# EAGLE design LoRa G-Dual v1.0 (EAGLE 7.5.0)
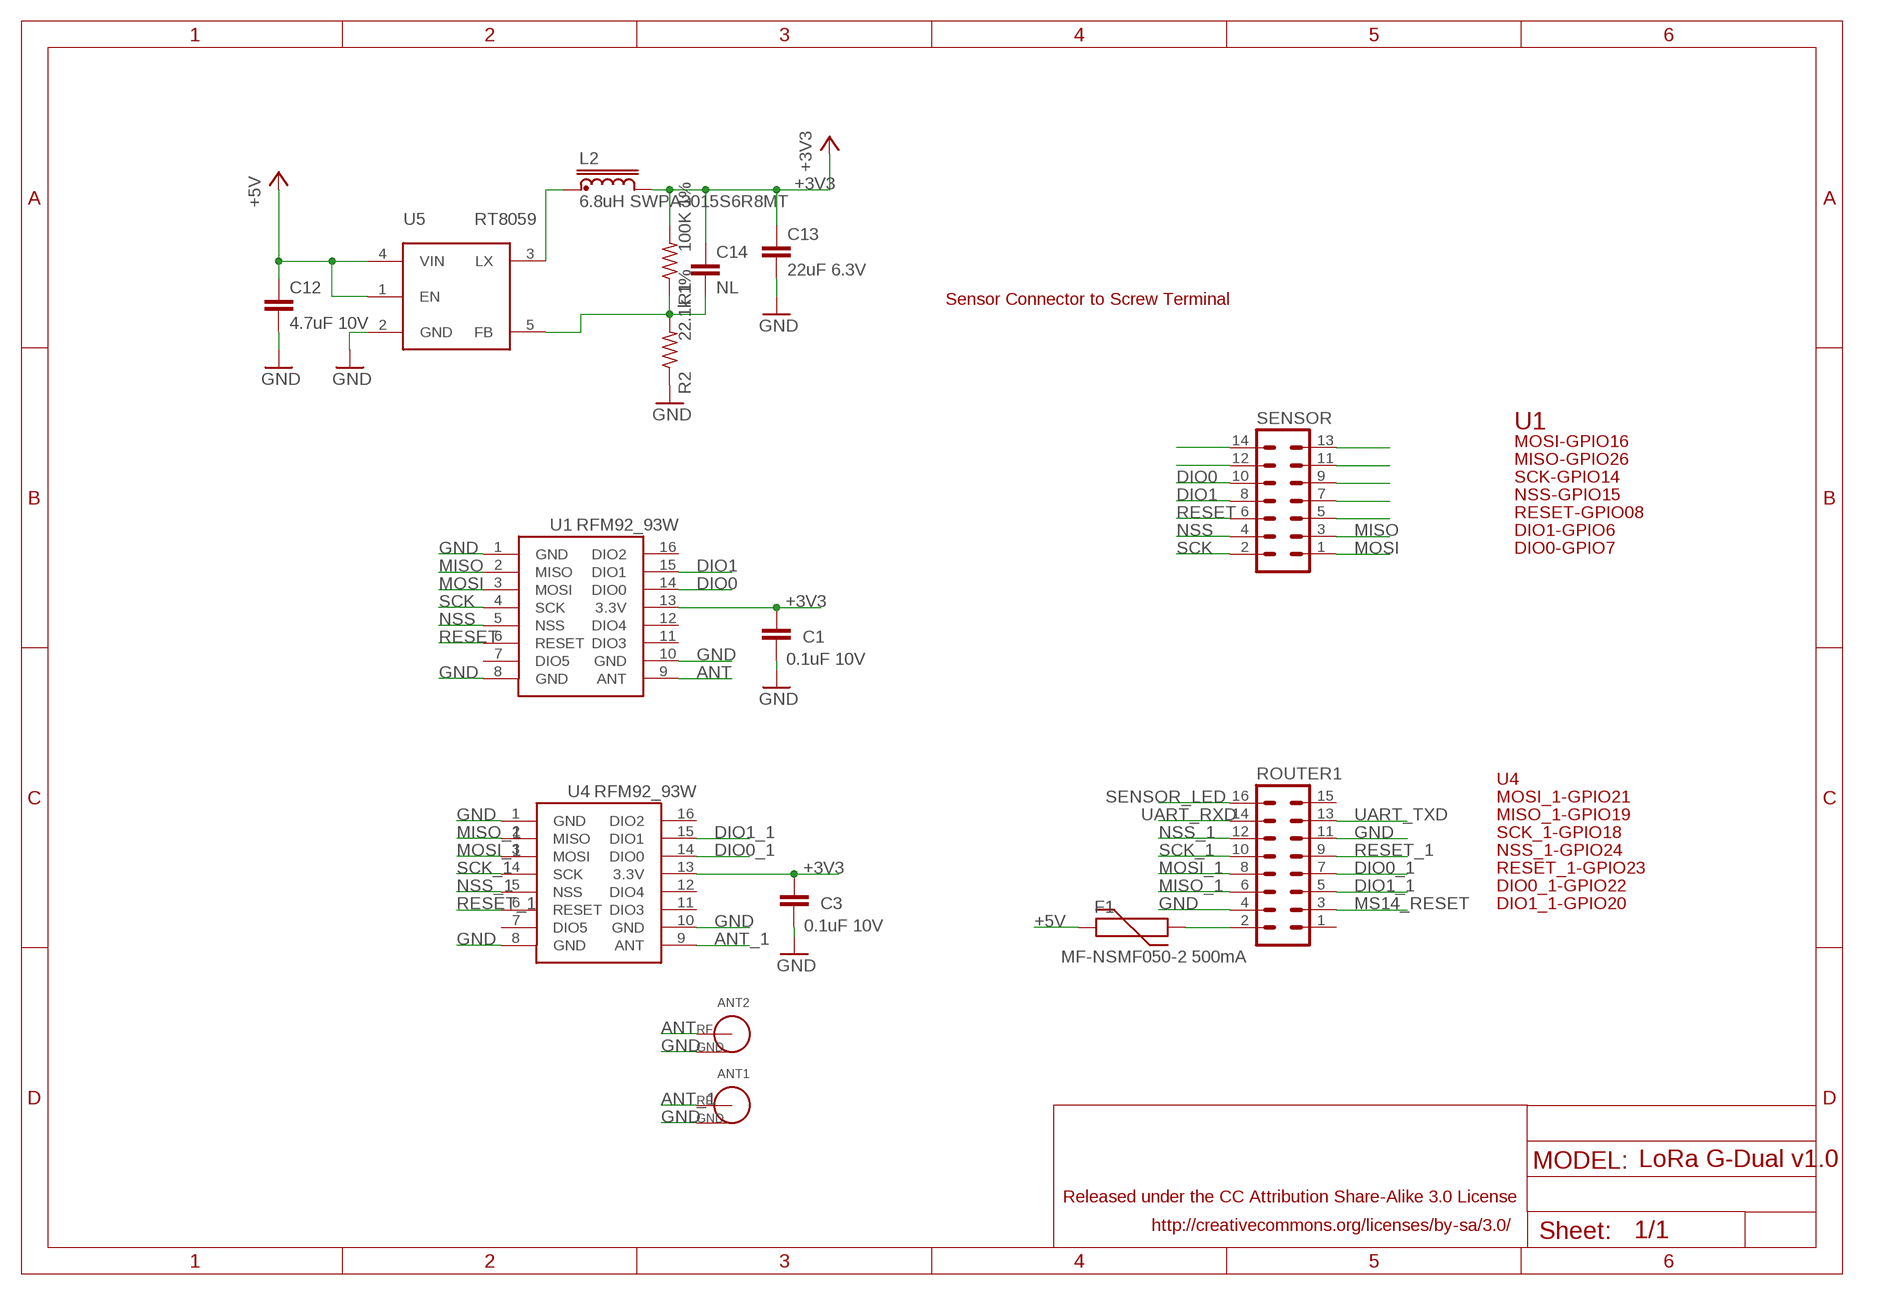
[diagram p0: schematic, sheet 1]

## Parts
ANT1  I-PEX  [I-PEX]
ANT2  I-PEX  [I-PEX]
C1  0.1uF 10V  C-EUC0402  [C0402]
C3  0.1uF 10V  C-EUC0402  [C0402]
C12  4.7uF 10V  C-EUC0402  [C0402]
C13  22uF 6.3V  C-EUC0603  [C0603@1]
C14  NL  C-EUC0402  [C0402]
F1  MF-NSMF050-2 500mA  FUSE1206  [R1206]
L2  6.8uH SWPA3015S6R8MT  INDUCTORSWPA3010S  [SWPA3010S]
R1  100K 1%  R-US_R0402  [R0402]
R2  22.1k 1%  R-US_R0402  [R0402]
ROUTER1  MA08-2  [MA08-2]
SENSOR  MA07-2  [MA07-2]
U1  RFM92_93W  [RFM92_93W]
U4  RFM92_93W  [RFM92_93W]
U5  RT8059  [SOT23-5]

## Nets
+3V3: C1.2 C3.2 C13.1 C14.1 L2.P$2 R1.2 U1.13(3.3V) U4.13(3.3V)
+5V: C12.1 F1.2 U5.1(EN) U5.4(VIN)
ANT [2layer-50ohm]: ANT2.SIG U1.9(ANT)
ANT_1 [2layer-50ohm]: ANT1.SIG U4.9(ANT)
DIO0: SENSOR.10 U1.14(DIO0)
DIO0_1: ROUTER1.7 U4.14(DIO0)
DIO1: SENSOR.8 U1.15(DIO1)
DIO1_1: ROUTER1.5 U4.15(DIO1)
GND [2layer_50ohm]: ANT1.GND ANT1.GND1(GND) ANT2.GND ANT2.GND1(GND) C1.1 C3.1 C12.2 C13.2 R2.1 ROUTER1.4 ROUTER1.11 U1.1(GND) U1.8(GND) U1.10(GND) U4.1(GND) U4.8(GND) U4.10(GND) U5.2(GND)
MISO: SENSOR.3 U1.2(MISO)
MISO_1: ROUTER1.6 U4.2(MISO)
MOSI: SENSOR.1 U1.3(MOSI)
MOSI_1: ROUTER1.8 U4.3(MOSI)
MS14_RESET: ROUTER1.3
N$1: SENSOR.7
N$2: SENSOR.13
N$4: SENSOR.9
N$5: SENSOR.5
N$6: SENSOR.12
N$7: SENSOR.11
N$8: L2.P$1 U5.3(LX)
N$9: C14.2 R1.1 R2.2 U5.5(FB)
N$10: F1.1 ROUTER1.2
N$11: SENSOR.14
NSS: SENSOR.4 U1.5(NSS)
NSS_1: ROUTER1.12 U4.5(NSS)
RESET: SENSOR.6 U1.6(RESET)
RESET_1: ROUTER1.9 U4.6(RESET)
SCK: SENSOR.2 U1.4(SCK)
SCK_1: ROUTER1.10 U4.4(SCK)
SENSOR_LED: ROUTER1.16
UART_RXD: ROUTER1.14
UART_TXD: ROUTER1.13
Unconnected: ROUTER1.1 ROUTER1.15 U1.7(DIO5) U1.11(DIO3) U1.12(DIO4) U1.16(DIO2) U4.7(DIO5) U4.11(DIO3) U4.12(DIO4) U4.16(DIO2)

## Notes on the sheet
- Sensor Connector to Screw Terminal
- U1
- MOSI-GPIO16
- MISO-GPIO26
- SCK-GPIO14
- NSS-GPIO15
- RESET-GPIO08
- DIO1-GPIO6
- DIO0-GPIO7
- U4
- MOSI_1-GPIO21
- MISO_1-GPIO19
- SCK_1-GPIO18
- NSS_1-GPIO24
- RESET_1-GPIO23
- DIO0_1-GPIO22
- DIO1_1-GPIO20

## Library data of the parts
ANT1 ANT2 = dragino-passive:I-PEX: I-PEX, U.F.L connector
C1 C3 = dragino-passive:C-EU: CAPACITOR, European symbol
C12-C14 = dragino:C-EU: CAPACITOR, European symbol
F1 = dragino:FUSE: FUSE 5 x 20 mm
L2 = dragino:INDUCTOR: CHOKE U15
R1 R2 = dragino:R-US_: RESISTOR, American symbol
ROUTER1 = dragino:MA08-2: PIN HEADER; OC_FARNELL: unknown; OC_NEWARK: unknown
SENSOR = dragino:MA07-2: PIN HEADER; OC_FARNELL: unknown; OC_NEWARK: unknown
U1 U4 = dragino:RFM92_93W
U5 = dragino:RT8059

## Net classes
0 default: width 0.203 mm, clearance 0.152 mm
1 2layer_50ohm: width 1.001 mm, clearance 0.2 mm
2 gnd: width 0.305 mm, drill 0.254 mm, clearance 0.203 mm
3 2layer-50ohm: width 1 mm, clearance 0.2 mm

## Board
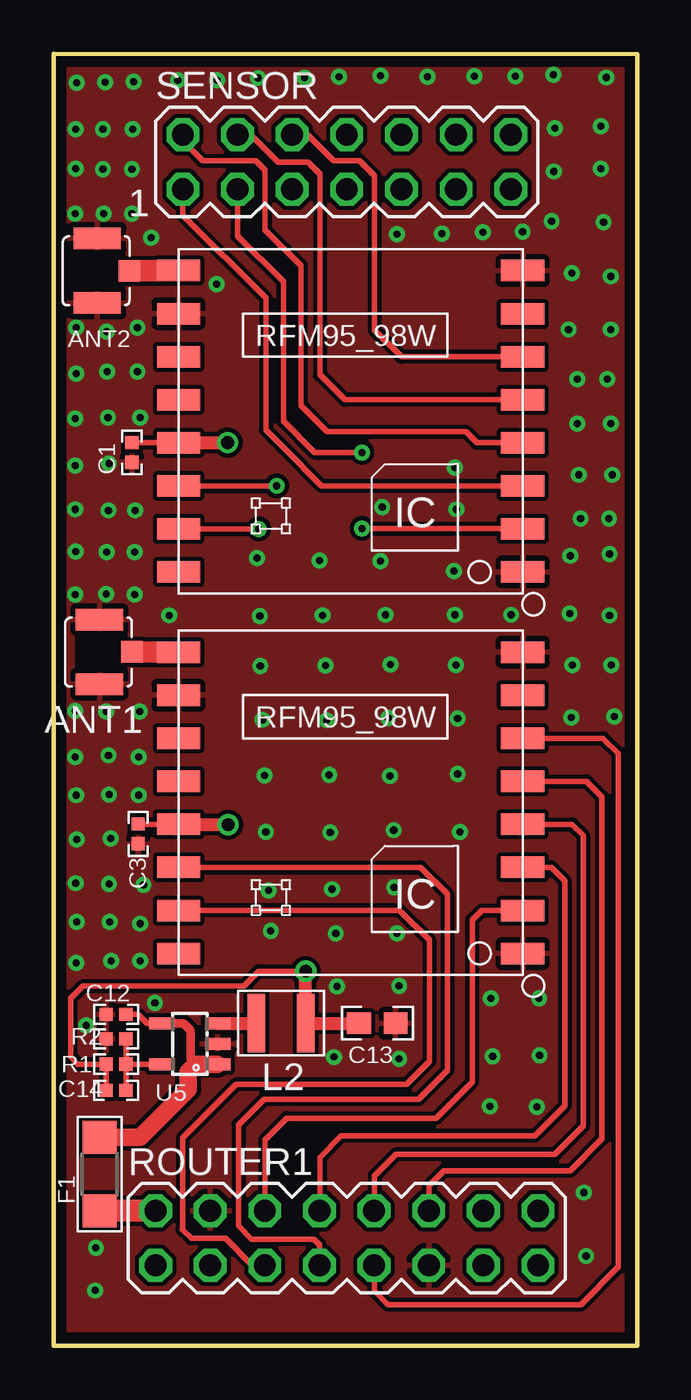
[diagram p1: board, top side]
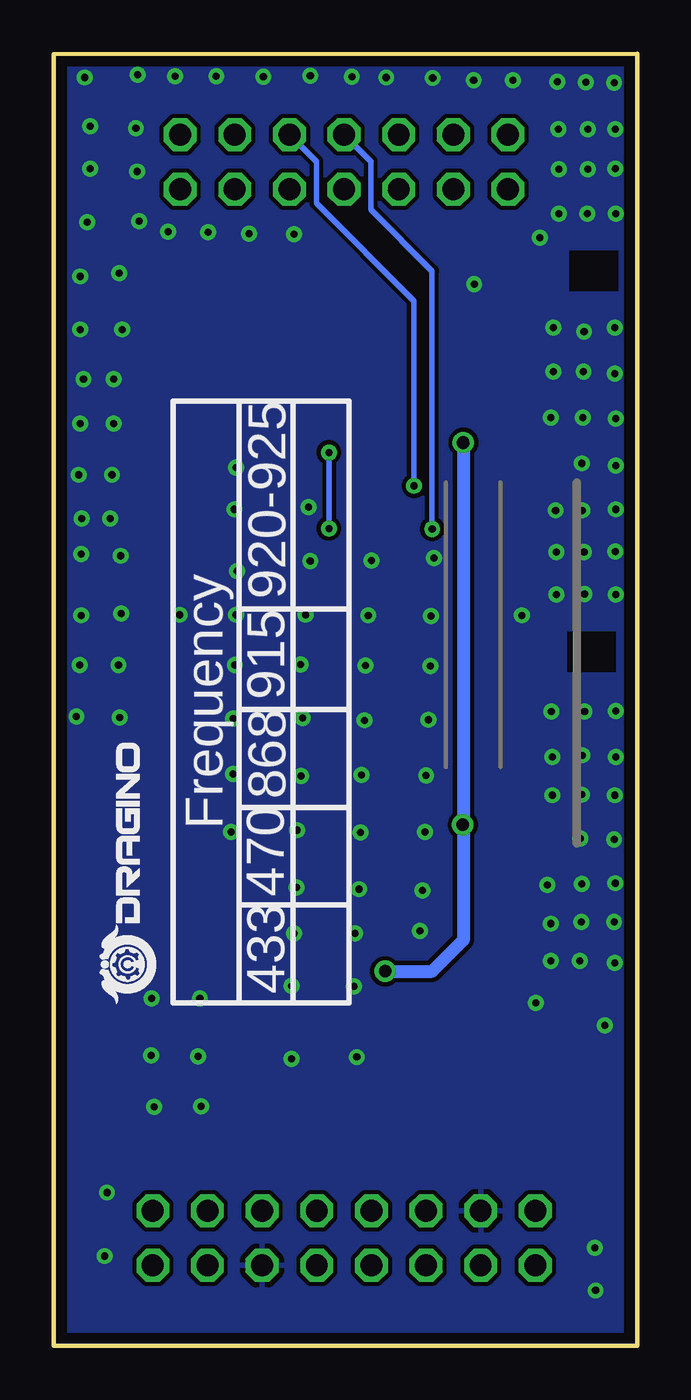
[diagram p2: board, bottom side, seen from below]

Size 27.11 x 60.03 mm. Coordinates in mm from the lower left corner, seen from the top.
Outline: 0,0 0,60.02 27.11,60 27.11,0 0,0
Copper layers (1*16): Top 0.035mm / dielectric 1.5mm / Bottom 0.035mm
Design rules "default *": minimum track width 6mil, minimum drill 10mil, track to track 6mil, track to pad 6mil, pad to pad 6mil, via to via 6mil, smd to smd 6mil, copper to edge 0.5mm, drill to drill 8mil, minimum pad ring 10mil, minimum via ring 8mil, stop-mask expansion 4mil, vias tented up to drill 30mil, thermal gap 10mil

### Footprints (pad centres in the part's own frame; a part is rotated, then mirrored left to right if it is on the bottom)
I-PEX = smd 1 x 2.2: GND -1.65,-0.27; GND1 1.35,-0.27 | smd 1 x 1: SIG -0.15,-1.77
C0402 = smd 0.61 x 0.61: 1 -0.457,0; 2 0.457,0
C0603@1 = smd 1.1 x 1: 1 -0.85,0; 2 0.85,0
R1206 = smd 1.52 x 1.6: 1 -1.71,0; 2 1.71,0
SWPA3010S = smd 0.8 x 2.7: P$1 -1.15,0; P$2 1.15,0
R0402 = smd 0.61 x 0.61: 1 -0.457,0; 2 0.457,0
MA08-2 = drill 1.016 octagon: 1 -8.89,-1.27; 2 -8.89,1.27; 3 -6.35,-1.27; 4 -6.35,1.27; 5 -3.81,-1.27; 6 -3.81,1.27; 7 -1.27,-1.27; 8 -1.27,1.27; 9 1.27,-1.27; 10 1.27,1.27; 11 3.81,-1.27; 12 3.81,1.27; 13 6.35,-1.27; 14 6.35,1.27; 15 8.89,-1.27; 16 8.89,1.27
MA07-2 = drill 1.016 octagon: 1 -7.62,-1.27; 2 -7.62,1.27; 3 -5.08,-1.27; 4 -5.08,1.27; 5 -2.54,-1.27; 6 -2.54,1.27; 7 0,-1.27; 8 0,1.27; 9 2.54,-1.27; 10 2.54,1.27; 11 5.08,-1.27; 12 5.08,1.27; 13 7.62,-1.27; 14 7.62,1.27
RFM92_93W = smd 2 x 1: 1 -8,7; 2 -8,5; 3 -8,3; 4 -8,1; 5 -8,-1; 6 -8,-3; 7 -8,-5; 8 -8,-7; 9 8,-7; 10 8,-5; 11 8,-3; 12 8,-1; 13 8,1; 14 8,3; 15 8,5; 16 8,7
SOT23-5 = smd 0.55 x 1.2: 1 -0.95,-1.3; 2 0,-1.3; 3 0.95,-1.3; 4 0.95,1.3; 5 -0.95,1.3

### Placement (x,y rotation side)
ANT1  1.85,32.38 90 top
ANT2  1.75,50.1 90 top
C1  3.63,41.5 90 top
C3  3.92,23.78 90 top
C12  2.9,15.39 180 top
C13  15.04,14.99 0 top
C14  2.9,11.86 0 top
F1  2.13,7.98 90 top
L2  10.57,14.99 0 top
R1  2.9,13.08 180 top
R2  2.9,14.25 0 top
ROUTER1  13.62,5 0 top
SENSOR  13.62,55 0 top
U1  13.79,42.95 180 top
U4  13.79,25.22 180 top
U5  6.32,14.02 90 top
U$1  [LOGO-DRAGINO-2018]  22.35,15.88 90 bottom

### Tracks (layer width: path | path; a pad name or v marks a point on that pad's centre or on a via)
+3V3  (via drill 0.58)
  Top 0.254: C14.1 R1.2 1.12,13.08 0.79,13.41 0.79,16.13 1.37,16.71 8.84,16.71 9.53,17.4 v11.71,17.4 | L2.P$2 | U1.13 3.64,41.95 C1.2 | U4.13 3.94,24.22 C3.2
  Top 0.61: L2.P$2 C13.1 | L2.P$2 v11.71,17.4 | U4.13 8.09,24.22 v8.1,24.21 | U1.13 v8.07,41.95 v8.08,41.96
  Bottom 0.61: v11.71,17.4 9.53,17.4 8.08,18.85 8.08,24.21 | v8.08,41.96 8.08,24.21 | 8.08,24.21 v8.1,24.21
+5V
  Top 0.254: U5.4 4.33,14.97 3.91,15.39 C12.1
  Top 0.406: U5.4 6.04,14.97 6.35,14.66 6.35,13.34 6.6,13.08
  Top 0.813: F1.2 4.02,9.69 6.25,11.91 6.25,12.72 6.6,13.08 7.61,13.08 U5.1
ANT
  Top 0.254: U1.9
  Top 1: ANT2.SIG U1.9
ANT_1
  Top 0.254: 5.78,32.23 U4.9
  Top 1: ANT1.SIG 5.78,32.23
DIO0  (via drill 0.33)
  Top 0.254: U1.14 v10.36,39.95
  Bottom 0.254: v10.36,39.95 10.36,48.54 14.91,53.09 14.91,55.02 SENSOR.10
DIO0_1
  Top 0.254: ROUTER1.7 12.35,4.69 12.09,4.95 9.2,4.95 8.58,5.56 8.58,10.26 9.78,11.46 16.94,11.46 18.29,12.8 18.29,20.98 17.05,22.22 U4.14
DIO1  (via drill 0.33)
  Top 0.254: U1.15 v9.52,37.95 v9.53,37.95
  Bottom 0.254: v9.53,37.95 9.53,49.94 12.37,52.78 12.37,55.02 SENSOR.8
DIO1_1
  Top 0.254: ROUTER1.5 9.22,3.73 7.98,4.98 6.4,4.98 5.97,5.41 5.99,5.44 5.99,9.65 8.48,12.14 16.38,12.14 17.45,13.21 17.45,18.85 16.08,20.22 U4.15
GND  (via drill 0.33)
  other vias: 4.7,15.93 1.5,14.88 0.99,29.49 2.44,29.46 3.99,29.46 0.99,34.9 2.44,34.92 3.76,34.9 1.04,47.29 2.46,47.12 3.89,47.29 0.99,52.6 2.31,52.6 3.63,52.6 1.02,36.91 2.46,36.88 3.76,36.88 0.99,38.86 2.54,38.81 3.78,38.81 0.99,40.89 2.57,41 0.99,43.08 2.51,43.13 4.01,43.13 1.04,45.16 2.49,45.26 3.89,45.26 1.02,54.69 2.29,54.66 3.63,54.66 1.02,56.52 2.29,56.52 3.66,56.52 1.07,58.67 2.39,58.7 3.71,58.72 5.77,58.8 7.59,58.8 9.5,58.9 23.29,56.57 5.36,33.93 9.58,33.91 12.5,33.93 15.42,33.96 18.64,33.96 21.26,33.96 23.98,34.01 25.83,33.93 24,36.7 25.83,36.78 24.1,31.62 25.91,31.62 24.05,29.18 26.06,29.24 22.56,16.13 20.32,16.13 20.4,13.44 22.58,13.49 20.27,11.13 22.45,11.1 13.03,13.41 16.05,13.34 13.16,16.69 16.05,16.71 13.11,19.15 15.95,19.15 10.08,19.28 9.98,21.16 12.93,21.21 15.82,21.29 9.86,23.88 12.85,23.85 15.8,23.95 18.87,23.88 9.8,26.49 12.8,26.52 15.62,26.47 18.77,26.57 9.7,29.08 12.67,29.06 15.54,29.16 18.77,29.13 9.6,31.57 12.62,31.6 15.65,31.65 18.69,31.62 0.99,27.36 2.54,27.43 3.94,27.36 1.04,25.58 2.57,25.6 3.94,25.58 1.07,23.52 2.64,23.57 1.02,21.49 2.57,21.46 4.17,21.41 1.07,19.68 2.59,19.68 4.01,19.61 1.04,17.78 2.67,17.88 4.01,17.88 1.96,4.55 1.93,2.57 24.64,7.11 24.74,4.17 9.45,36.6 12.34,36.47 15.19,36.45 18.59,35.99 15.27,38.96 18.72,38.86 18.64,40.79 11.66,58.93 13.26,58.95 15.19,59 17.37,58.95 19.56,58.98 21.46,58.98 23.22,59.05 25.68,58.93 25.43,56.67 23.24,54.56 25.43,54.69 23.14,52.25 25.55,52.2 15.95,51.64 18.03,51.66 19.94,51.74 21.79,51.77 24.08,49.83 25.88,49.68 23.93,47.22 25.88,47.22 24.33,44.91 25.73,44.91 24.33,42.85 25.88,42.85 24.41,40.46 25.96,40.46 24.49,38.43 25.81,38.43 4.52,51.49 7.57,49.33
  pour Top: 27.41,-0.34 -0.15,-0.52 -0.33,52.07 -0.33,61.17 -0.3,61.17 27.74,61.1
  pour Bottom: 27.28,-0.22 -0.18,-0.47 -0.28,34.54 -0.36,61.17 27.58,61.23
MISO  (via drill 0.33)
  Top 0.254: SENSOR.3 8.54,51.56 10.67,49.43 10.67,42.95 12.12,41.5 v14.33,41.5 | v14.33,37.97 21.77,37.97 U1.2
  Bottom 0.254: v14.33,41.5 v14.33,37.97
MISO_1
  Top 0.254: ROUTER1.6 9.83,6.29 9.83,9.58 10.82,10.57 17.75,10.57 19.46,12.27 19.46,19.79 19.89,20.22 U4.2
MOSI
  Top 0.254: U1.3 12.45,39.95 10.65,41.74 10.21,42.19 9.86,42.55 9.86,48.67 6,52.52 SENSOR.1
MOSI_1
  Top 0.254: ROUTER1.8 12.37,6.29 12.37,8.76 13.36,9.75 22.35,9.75 23.75,11.15 23.75,21.59 23.12,22.22 U4.3
N$8
  Top 0.61: U5.3 9.4,14.97 L2.P$1
N$9
  Top 0.254: C14.2 R1.1 | R2.2 R1.1 | U5.5 3.36,13.07 R1.1
N$10
  Top 1.016: ROUTER1.2 F1.1
NSS
  Top 0.254: U1.5 13.53,43.95 12.37,45.11 12.37,54.43 11.81,54.99 10.41,54.99 9.13,56.27 SENSOR.4
NSS_1
  Top 0.254: ROUTER1.12 17.43,7.42 18.14,8.13 24,8.13 25.48,9.6 25.48,25.5 24.76,26.22 U4.5
RESET
  Top 0.254: U1.6 16.15,45.95 14.91,47.19 14.91,54.36 14.2,55.07 13,55.07 11.8,56.27 SENSOR.6
RESET_1
  Top 0.254: ROUTER1.9 14.91,3.71 14.91,2.54 15.49,1.96 15.52,1.93 15.54,1.91 24.49,1.91 26.24,3.66 26.24,27.51 25.52,28.22 U4.6
SCK
  Top 0.254: SENSOR.2 6,55.98 6.91,55.07 9.37,55.07 9.83,54.61 9.83,51.84 11.48,50.19 11.48,43.69 12.7,42.47 19.15,42.47 19.66,41.96 U1.4
SCK_1
  Top 0.254: ROUTER1.10 14.91,6.29 14.91,7.9 15.9,8.89 23.29,8.89 24.61,10.21 24.61,23.7 24.09,24.22 U4.4

### Text on the board
bPlace: 920-925 | 915 | 868 | Frequency | 470 | 433
bDocu: LoRa G-Dual v1.0 | OPEN-SOURCE | WWW.DRAGINO.COM | LoRa MODEL.